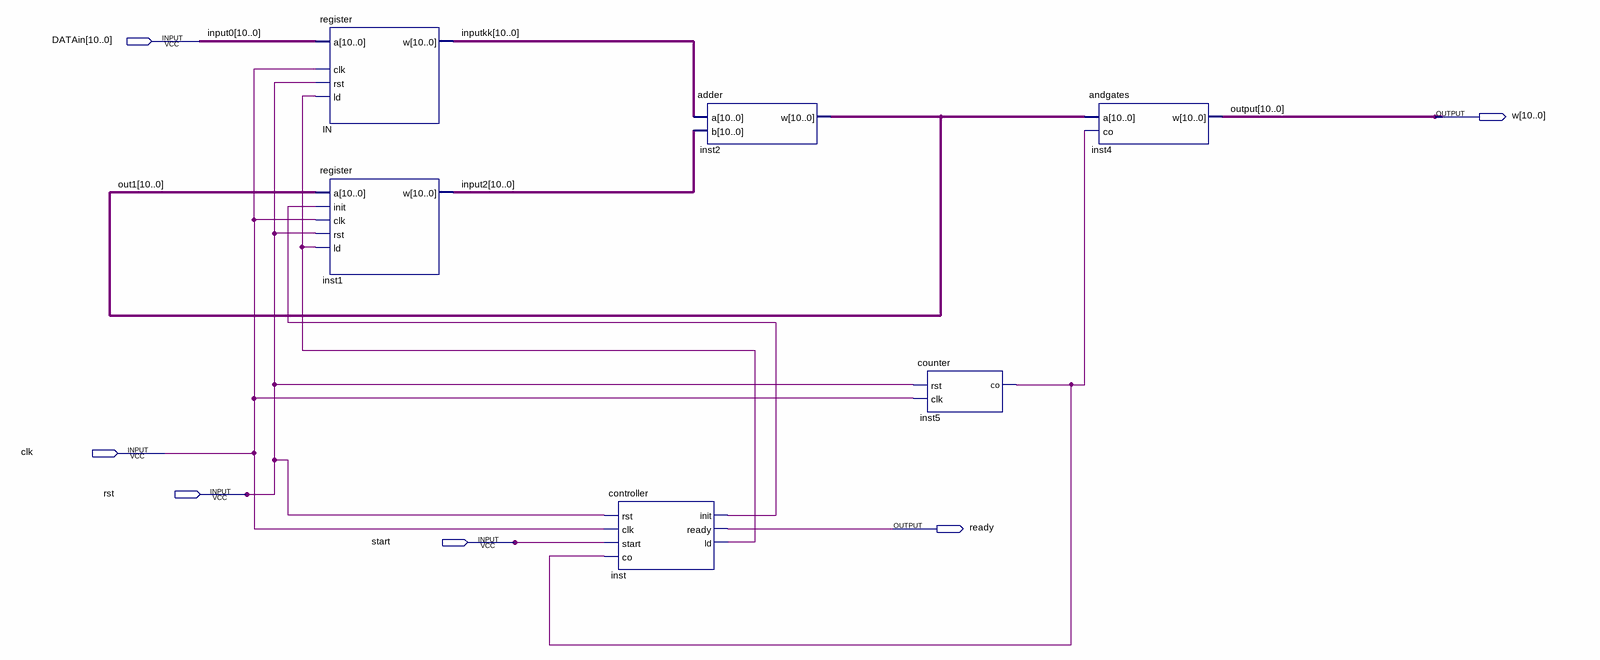
[diagram p0: schematic sheet]
// Quartus schematic avrage.bdf as structural Verilog: 6 symbols, 6 pins
module avrage (
  input  [10:0] DATAin,
  input  clk,
  input  rst,
  input  start,
  output [10:0] w,
  output ready
);

  wire inst5_co, inst_init, inst_ld;
  wire [10:0] input2, inputkk, out1;

  register IN (.a(DATAin), .clk(clk), .rst(rst), .ld(inst_ld), .w(inputkk));
  register inst1 (.a(out1), .init(inst_init), .clk(clk), .rst(rst), .ld(inst_ld), .w(input2));
  controller inst (.rst(rst), .clk(clk), .start(start), .co(inst5_co), .init(inst_init), .ready(ready), .ld(inst_ld));
  adder inst2 (.a(inputkk), .b(input2), .w(out1));
  counter inst5 (.rst(rst), .clk(clk), .co(inst5_co));
  andgates inst4 (.a(out1), .co(inst5_co), .w(w));

  // Other names for the same wires on the sheet: input0[10:0] = DATAin; output[10:0] = w
endmodule
